# Altium schematic sheet 海关全向本体电路板V3_通信隔离.SchDoc
size A4
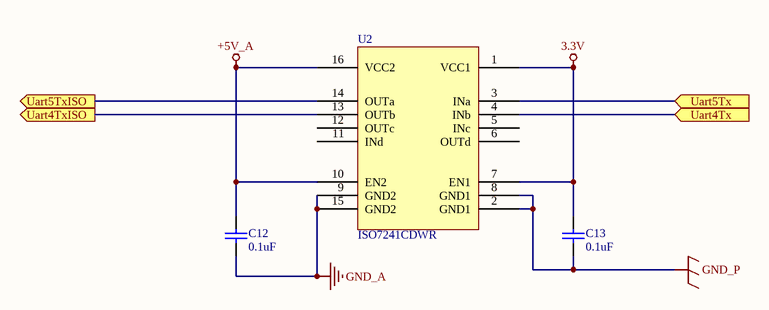
[diagram p0: 海关全向本体电路板V3_通信隔离.SchDoc]

## Parts
C12  0.1uF  [C0603-S]
C13  0.1uF  [C0603-S]
U2  ISO7241CDWR  [SO16-290]

## Ports
Uart4Tx (in), Uart4TxISO (out), Uart5Tx (in), Uart5TxISO (out)

## Nets
3.3V: C13.2 U2.1(VCC1) U2.7(EN1)
+5V_A: C12.2 U2.10(EN2) U2.16(VCC2)
GND_A: C12.1 U2.9(GND2) U2.15(GND2)
GND_P: C13.1 U2.2(GND1) U2.8(GND1)
Uart4Tx: U2.4(INb) ; port Uart4Tx
Uart4TxISO: U2.13(OUTb) ; port Uart4TxISO
Uart5Tx: U2.3(INa) ; port Uart5Tx
Uart5TxISO: U2.14(OUTa) ; port Uart5TxISO

Not connected (* = marked no-connect by the designer): U2 5(INc) 6(OUTd) 11(INd) 12(OUTc)

## Library data of the parts
C12 C13 = Cap Semi
U2 = ISO7241A: Octal bus transceiver and 3.3V to 5V shifter with 3-state outputs